# EAGLE schematic ST-BOARD-1-02 (EAGLE 9.3.0)

## Sheet 1 of 4
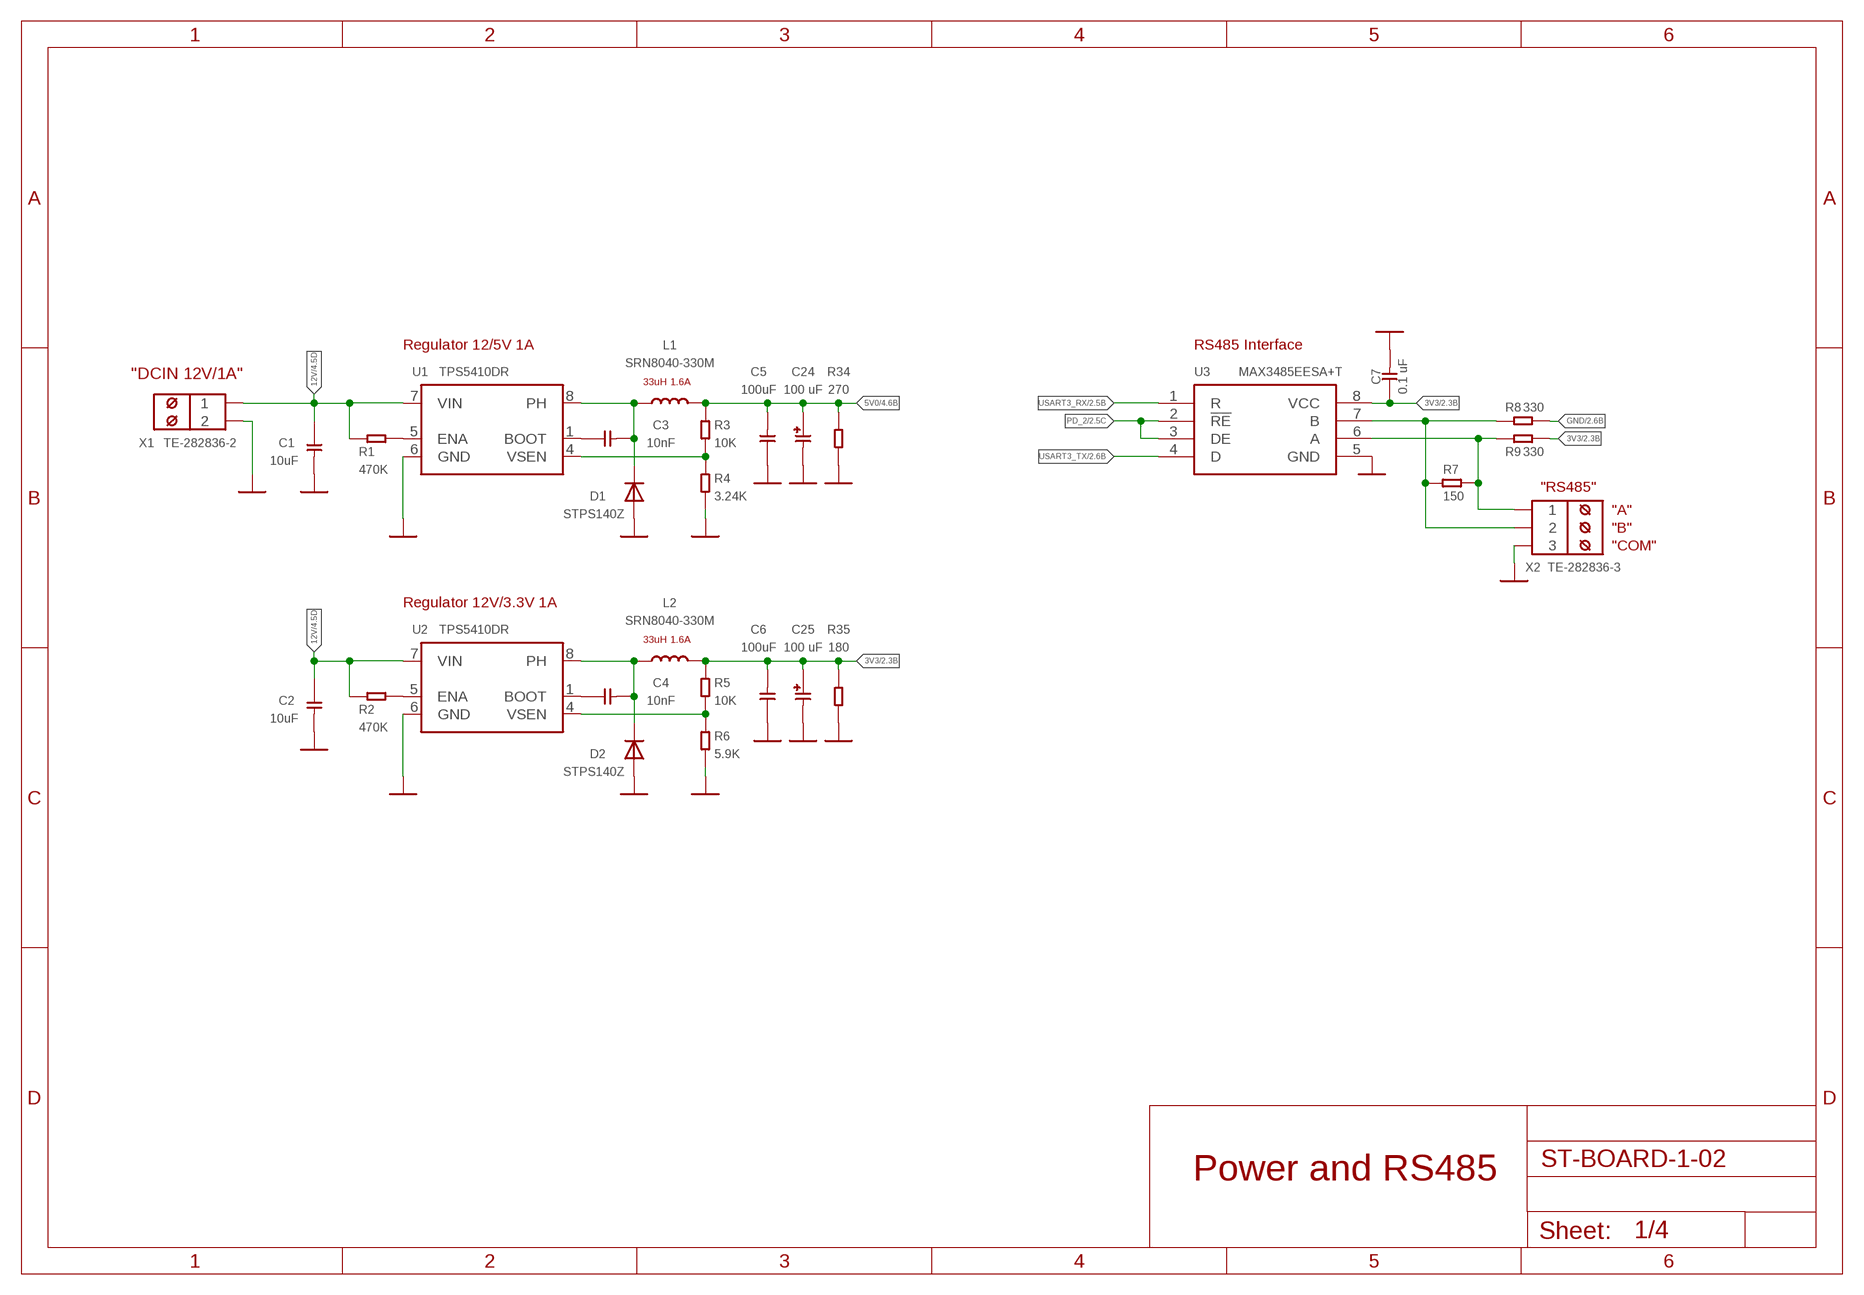
[diagram p0: schematic, sheet 1]

### Parts
C1  10uF  CHIP-CAPACITORC1206  [C1206]
C2  10uF  CHIP-CAPACITORC1206  [C1206]
C3  10nF  CHIP-CAPACITORC0603  [C0603]
C4  10nF  CHIP-CAPACITORC0603  [C0603]
C5  100uF  CHIP-CAPACITORC1206  [C1206]
C6  100uF  CHIP-CAPACITORC1206  [C1206]
C7  0.1 uF  CHIP-CAPACITORC0603  [C0603]
C24  100 uF  TANT-CAPACITOR_D  [CT7343]
C25  100 uF  TANT-CAPACITOR_D  [CT7343]
D1  STPS140Z  DIODE_SOD-123  [SOD-123]
D2  STPS140Z  DIODE_SOD-123  [SOD-123]
L1  SRN8040-330M  CHIP-INDUCTOR_SRN8040  [SRN8040]
L2  SRN8040-330M  CHIP-INDUCTOR_SRN8040  [SRN8040]
R1  470K  CHIP-RESISTOR-0603  [R0603]
R2  470K  CHIP-RESISTOR-0603  [R0603]
R3  10K  CHIP-RESISTOR-0603  [R0603]
R4  3.24K  CHIP-RESISTOR-0603  [R0603]
R5  10K  CHIP-RESISTOR-0603  [R0603]
R6  5.9K  CHIP-RESISTOR-0603  [R0603]
R7  150  CHIP-RESISTOR-0805  [R0805]
R8  330  CHIP-RESISTOR-0603  [R0603]
R9  330  CHIP-RESISTOR-0603  [R0603]
R34  270  CHIP-RESISTOR-1206  [R1206]
R35  180  CHIP-RESISTOR-1206  [R1206]
U1  TPS5410DR  TPS5450_SOIC8  [SOIC8]
U2  TPS5410DR  TPS5450_SOIC8  [SOIC8]
U3  MAX3485EESA+T  MAX3485  [SOIC8]
X1  TE-282836-2  [W237-102]
X2  TE-282836-3  [W237-103]

### Nets
3V3: C6.2 C7.1 C25.+ L2.2 R5.2 R9.1 R35.2 U3.8(VCC) ; also sheet 2,3,4
5V0: C5.2 C24.+ L1.2 R3.2 R34.2 ; also sheet 4
12V: C1.1 C2.1 R1.2 R2.2 U1.7(VIN) U2.7(VIN) X1.1 ; also sheet 4
A: R7.2 R9.2 U3.6(A) X2.1
B: R7.1 R8.2 U3.7(B) X2.2
GND: C1.2 C2.2 C5.1 C6.1 C7.2 C24.- C25.- D1.+ D2.+ R4.1 R6.1 R8.1 R34.1 R35.1 U1.6(GND) U2.6(GND) U3.5(GND) X1.2 X2.3 ; also sheet 2,3,4
LM_SW1: C3.2 D1.- L1.1 U1.8(PH)
LM_SW3: C4.2 D2.- L2.1 U2.8(PH)
N$2: R3.1 R4.2 U1.4(VSEN)
N$3: C3.1 U1.1(BOOT)
N$4: R1.1 U1.5(ENA)
N$10: R5.1 R6.2 U2.4(VSEN)
N$11: C4.1 U2.1(BOOT)
N$12: R2.1 U2.5(ENA)
PD_2: U3.2(!RE) U3.3(DE) ; also sheet 2
USART3_RX: U3.1(R) ; also sheet 2
USART3_TX: U3.4(D) ; also sheet 2

### Notes on the sheet
- Regulator 12/5V 1A | RS485 Interface
- "DCIN 12V/1A"
- 33uH 1.6A
- "RS485"
- "A"
- "B"
- "COM"
- Regulator 12V/3.3V 1A
- 33uH 1.6A
- Power and RS485

## Sheet 2 of 4
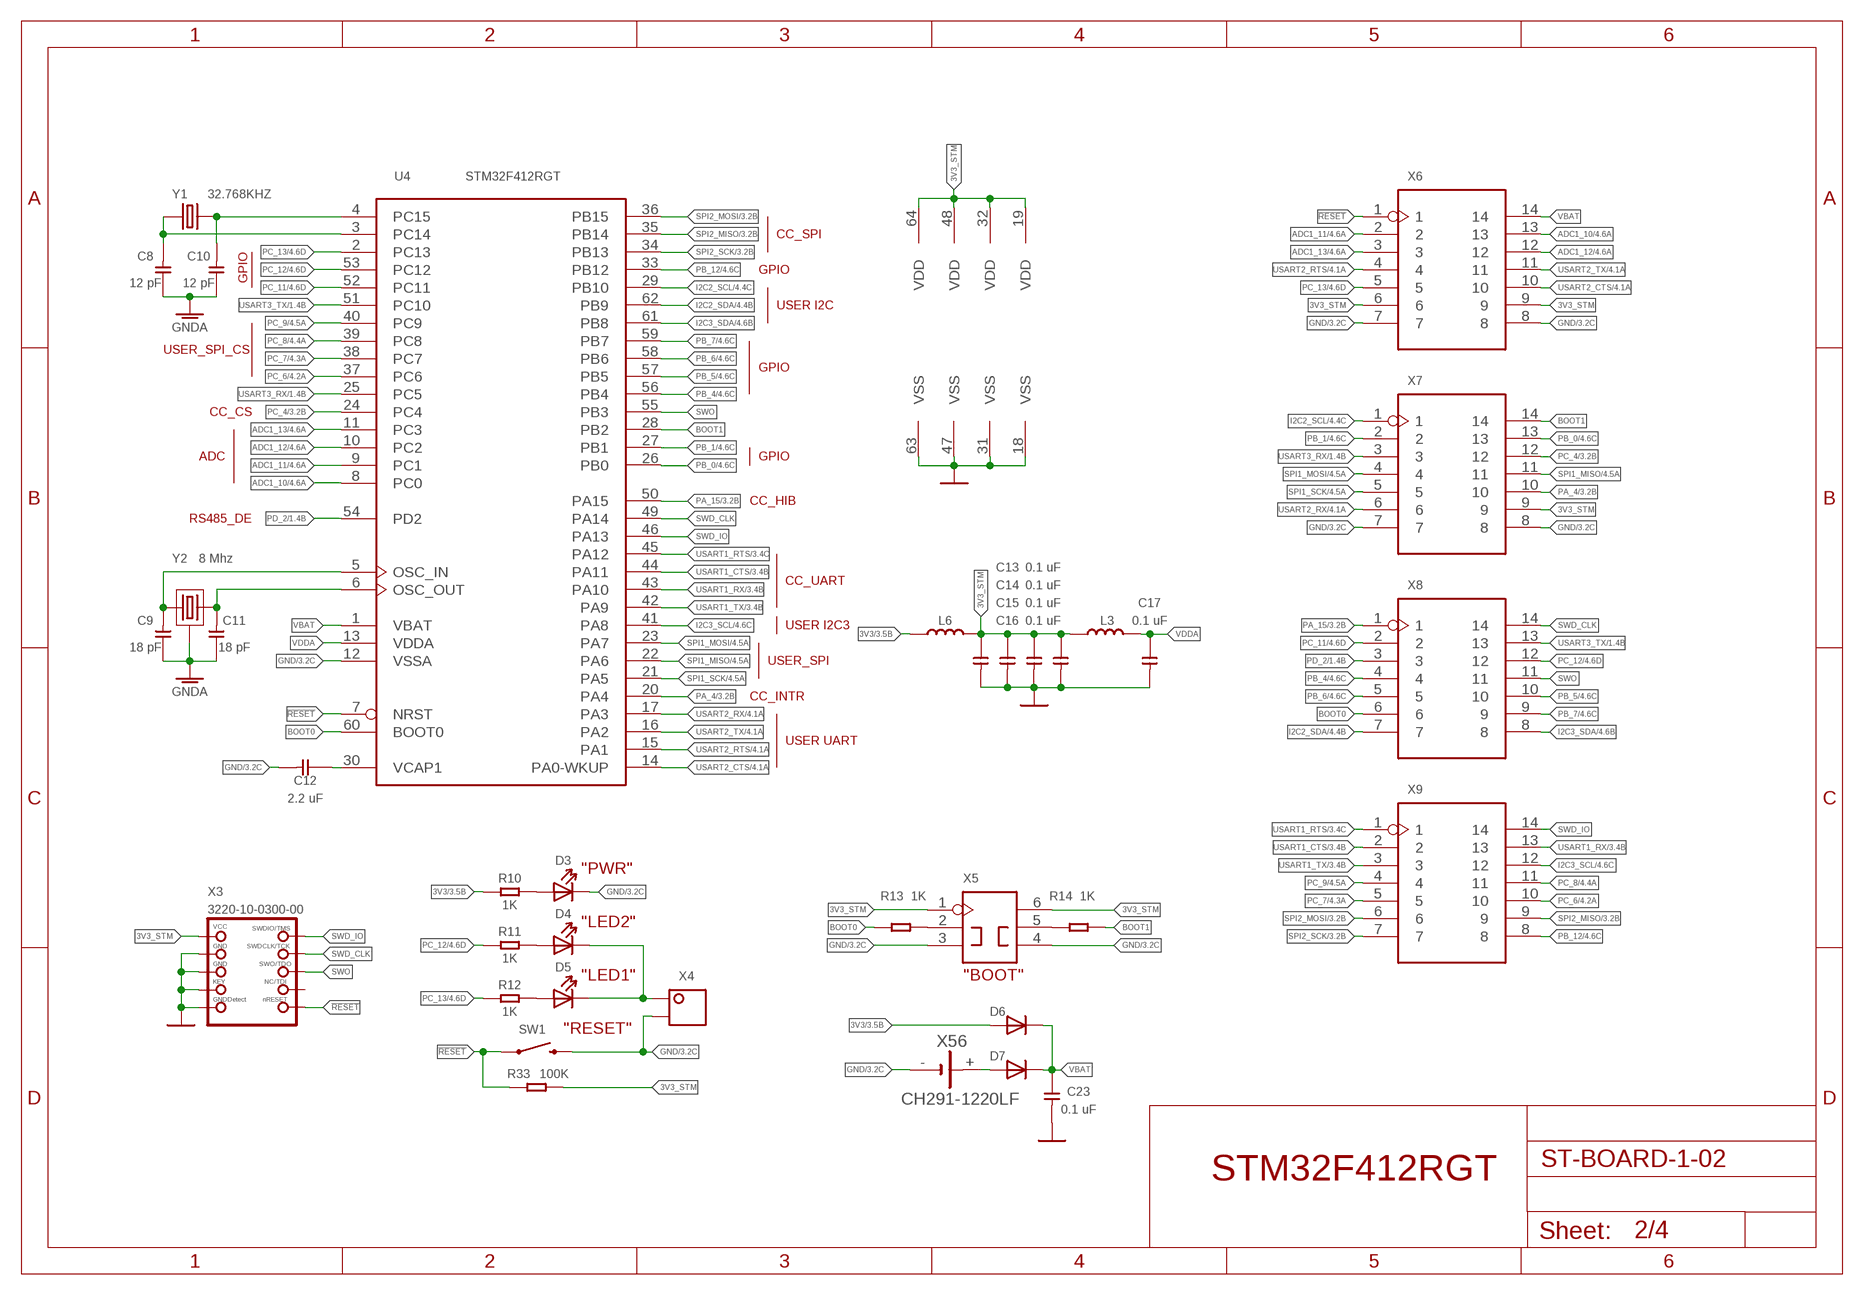
[diagram p1: schematic, sheet 2]

### Parts
C8  12 pF  CHIP-CAPACITORC0603  [C0603]
C9  18 pF  CHIP-CAPACITORC0603  [C0603]
C10  12 pF  CHIP-CAPACITORC0603  [C0603]
C11  18 pF  CHIP-CAPACITORC0603  [C0603]
C12  2.2 uF  CHIP-CAPACITORC0603  [C0603]
C13  0.1 uF  CHIP-CAPACITORC0603  [C0603]
C14  0.1 uF  CHIP-CAPACITORC0603  [C0603]
C15  0.1 uF  CHIP-CAPACITORC0603  [C0603]
C16  0.1 uF  CHIP-CAPACITORC0603  [C0603]
C17  0.1 uF  CHIP-CAPACITORC0603  [C0603]
C23  0.1 uF  CHIP-CAPACITORC0603  [C0603]
D3  LED-0603  [LED-0603]
D4  LED-0603  [LED-0603]
D5  LED-0603  [LED-0603]
D6  DIODE_SOD-523  [SOD-523]
D7  DIODE_SOD-523  [SOD-523]
L3  CHIP-INDUCTOR_L0603  [L0603]
L6  CHIP-INDUCTOR_L0603  [L0603]
R10  1K  CHIP-RESISTOR-0603  [R0603]
R11  1K  CHIP-RESISTOR-0603  [R0603]
R12  1K  CHIP-RESISTOR-0603  [R0603]
R13  1K  CHIP-RESISTOR-0603  [R0603]
R14  1K  CHIP-RESISTOR-0603  [R0603]
R33  100K  CHIP-RESISTOR-0603  [R0603]
SW1  TE-1437566-3  [TE-1437566-3]
U4  STM32F412RGT  [LQFP64]
X3  3220-10-0300-00  JTAG-CORTEXBOX  [2X05_1.27MM_BOX_NOPOSTS]
X4  2p-2.54  DIP-HEADER-VERT(2P-2.54)  [H2-2.54]
X5  2x3p-2.54  DIP-HEADER-VERT(2X3P-2.54）-2.54  [H2X3-2.54]
X6  DIP-HEADER-VERT(2X7P-2.54)  [H2X7-2.54]
X7  DIP-HEADER-VERT(2X7P-2.54)  [H2X7-2.54]
X8  DIP-HEADER-VERT(2X7P-2.54)  [H2X7-2.54]
X9  DIP-HEADER-VERT(2X7P-2.54)  [H2X7-2.54]
X56  CH291-1220LF  [CH291-1220LF]
Y1  32.768KHZ  SMD-CRYSTAL_32X15  [3.2X1.5]
Y2  8 Mhz  SMD-CRYSTAL-3225_5032B  [IQG5032B]

### Nets
3V3: D6.+ L6.1 R10.1 ; also sheet 1,3,4
3V3_STM: C13.1 C14.1 C15.1 C16.1 L3.2 L6.2 R33.1 U4.19(VDD) U4.32(VDD) U4.48(VDD) U4.64(VDD) X3.1(VCC) X5.1 X5.6 X6.6 X6.9 X7.9
!RESET: R33.2 SW1.P$1 U4.7(NRST) X3.10(NRESET) X6.1
ADC1_10: U4.8(PC0) X6.13 ; also sheet 4
ADC1_11: U4.9(PC1) X6.2 ; also sheet 4
ADC1_12: U4.10(PC2) X6.12 ; also sheet 4
ADC1_13: U4.11(PC3) X6.3 ; also sheet 4
BOOT0: R13.1 U4.60(BOOT0) X8.6
BOOT1: R14.1 U4.28(PB2) X7.14
GND: C12.2 C13.2 C14.2 C15.2 C16.2 C17.2 C23.2 D3.- SW1.P$2 U4.12(VSSA) U4.18(VSS) U4.31(VSS) U4.47(VSS) U4.63(VSS) X3.3(GND) X3.5(GND) X3.7(KEY) X3.9(GNDDETECT) X4.2 X5.3 X5.4 X6.7 X6.8 X7.7 X7.8 X56.- ; also sheet 1,3,4
GNDA: C8.1 C9.1 C10.1 C11.1 Y2.2(GND) Y2.4(GND)
I2C2_SCL: U4.29(PB10) X7.1 ; also sheet 4
I2C2_SDA: U4.62(PB9) X8.7 ; also sheet 4
I2C3_SCL: U4.41(PA8) X9.12 ; also sheet 4
I2C3_SDA: U4.61(PB8) X8.8 ; also sheet 4
N$1: C10.2 U4.4(PC15) Y1.2
N$6: C8.2 U4.3(PC14) Y1.1
N$8: C12.1 U4.30(VCAP1)
N$42: C11.2 U4.6(OSC_OUT) Y2.3
N$43: C9.2 U4.5(OSC_IN) Y2.1
N$44: D3.+ R10.2
N$45: D4.+ R11.2
N$46: D5.+ R12.2
N$47: D7.+ X56.+
N$48: R14.2 X5.5
N$49: R13.2 X5.2
N$50: D4.- D5.- X4.1
PA_4: U4.20(PA4) X7.10 ; also sheet 3
PA_15: U4.50(PA15) X8.1 ; also sheet 3
PB_0: U4.26(PB0) X7.13 ; also sheet 4
PB_1: U4.27(PB1) X7.2 ; also sheet 4
PB_4: U4.56(PB4) X8.4 ; also sheet 4
PB_5: U4.57(PB5) X8.10 ; also sheet 4
PB_6: U4.58(PB6) X8.5 ; also sheet 4
PB_7: U4.59(PB7) X8.9 ; also sheet 4
PB_12: U4.33(PB12) X9.8 ; also sheet 4
PC_4: U4.24(PC4) X7.12 ; also sheet 3
PC_6: U4.37(PC6) X9.10 ; also sheet 4
PC_7: U4.38(PC7) X9.5 ; also sheet 4
PC_8: U4.39(PC8) X9.11 ; also sheet 4
PC_9: U4.40(PC9) X9.4 ; also sheet 4
PC_11: U4.52(PC11) X8.2 ; also sheet 4
PC_12: R11.1 U4.53(PC12) X8.12 ; also sheet 4
PC_13: R12.1 U4.2(PC13) X6.5 ; also sheet 4
PD_2: U4.54(PD2) X8.3 ; also sheet 1
SPI1_MISO: U4.22(PA6) X7.11 ; also sheet 4
SPI1_MOSI: U4.23(PA7) X7.4 ; also sheet 4
SPI1_SCK: U4.21(PA5) X7.5 ; also sheet 4
SPI2_MISO: U4.35(PB14) X9.9 ; also sheet 3
SPI2_MOSI: U4.36(PB15) X9.6 ; also sheet 3
SPI2_SCK: U4.34(PB13) X9.7 ; also sheet 3
SWD_CLK: U4.49(PA14) X3.4(SWDCLK) X8.14
SWD_IO: U4.46(PA13) X3.2(SWDIO) X9.14
SWO: U4.55(PB3) X3.6(SWO) X8.11
USART1_CTS: U4.44(PA11) X9.2 ; also sheet 3
USART1_RTS: U4.45(PA12) X9.1 ; also sheet 3
USART1_RX: U4.43(PA10) X9.13 ; also sheet 3
USART1_TX: U4.42(PA9) X9.3 ; also sheet 3
USART2_CTS: U4.14(PA0-WKUP) X6.10 ; also sheet 4
USART2_RTS: U4.15(PA1) X6.4 ; also sheet 4
USART2_RX: U4.17(PA3) X7.6 ; also sheet 4
USART2_TX: U4.16(PA2) X6.11 ; also sheet 4
USART3_RX: U4.25(PC5) X7.3 ; also sheet 1
USART3_TX: U4.51(PC10) X8.13 ; also sheet 1
VBAT: C23.1 D6.- D7.- U4.1(VBAT) X6.14
VDDA: C17.1 L3.1 U4.13(VDDA)
Unconnected: X3.8(TDI)

### Notes on the sheet
- CC_SPI
- GPIO
- GPIO
- USER I2C
- USER_SPI_CS
- GPIO
- CC_CS
- ADC | GPIO
- CC_HIB
- RS485_DE
- CC_UART
- USER I2C3
- USER_SPI
- CC_INTR
- USER UART
- "PWR"
- "LED2"
- "LED1" | "BOOT"
- "RESET"
- STM32F412RGT

## Sheet 3 of 4
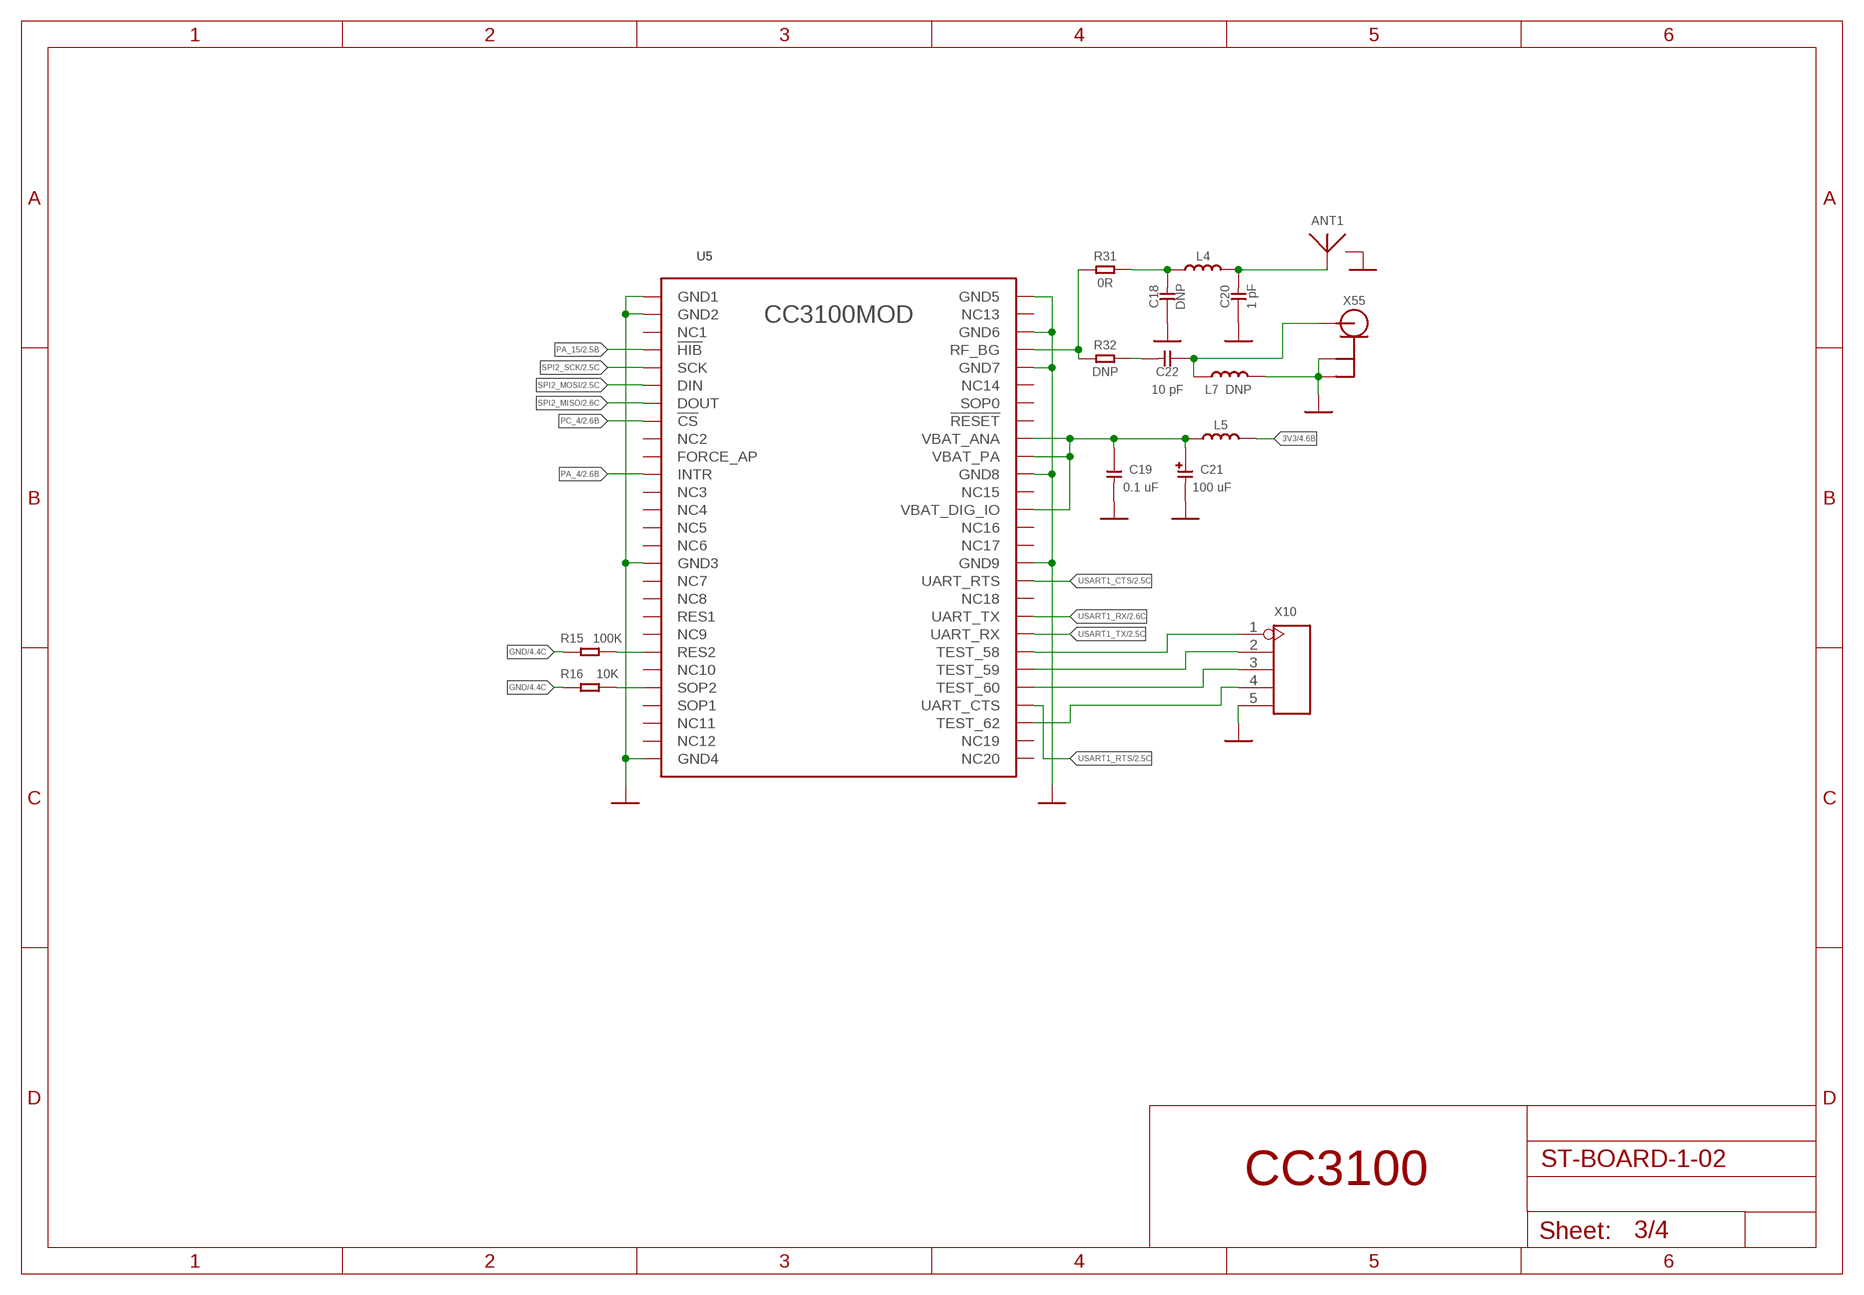
[diagram p2: schematic, sheet 3]

### Parts
ANT1  AH316M245001-T  AH316M  [AH316M]
C18  DNP  CHIP-CAPACITORC0402  [C0402]
C19  0.1 uF  CHIP-CAPACITORC0603  [C0603]
C20  1 pF  CHIP-CAPACITORC0402  [C0402]
C21  100 uF  TANT-CAPACITOR_B  [CT3528]
C22  10 pF  CHIP-CAPACITORC0402  [C0402]
L4  CHIP-INDUCTOR_L0402  [L0402]
L5  CHIP-INDUCTOR_L0603  [L0603]
L7  DNP  CHIP-INDUCTOR_L0402  [L0402]
R15  100K  CHIP-RESISTOR-0603  [R0603]
R16  10K  CHIP-RESISTOR-0603  [R0603]
R31  0R  CHIP-RESISTOR-0402  [R0402]
R32  DNP  CHIP-RESISTOR-0402  [R0402]
U5  CC3100MOD  [CC3100MOD]
X10  2p-2.54  DIP-HEADER-VERT(5P-2.54)  [H5-2.54]
X55  UFL3  [U-FL3P-SMD-2.6X2.6X1.0MM]

### Nets
3V3: L5.2 ; also sheet 1,2,4
GND: ANT1.P$2(GND) C18.1 C19.2 C20.1 C21.- L7.2 R15.1 R16.1 U5.P1(GND1) U5.P2(GND2) U5.P16(GND3) U5.P27(GND4) U5.P28(GND5) U5.P30(GND6) U5.P32(GND7) U5.P38(GND8) U5.P43(GND9) U5.P55(GND1) U5.P56(GND1) U5.P57(GND1) U5.P58(GND1) U5.P59(GND1) U5.P60(GND1) U5.P61(GND1) U5.P62(GND1) U5.P63(GND1) X10.5 X55.GND1(GND) X55.GND2(GND1) ; also sheet 1,2,4
N$9: R15.2 U5.P21(RES2)
N$14: R16.2 U5.P23(SOP2)
N$15 [rf]: R31.1 R32.1 U5.P31(RF_BG)
N$16 [rf]: ANT1.P$1(ANT) C20.2 L4.2
N$20: C19.1 C21.+ L5.1 U5.P36(VBAT_ANA) U5.P37(VBAT_PA) U5.P40(VBAT_DIG_IO)
N$52 [rf]: C18.2 L4.1 R31.2
N$53 [rf]: C22.2 R32.2
N$54 [rf]: C22.1 L7.1 X55.D(ANT)
PA_4: U5.P11(INTR) ; also sheet 2
PA_15: U5.P4(!HIB) ; also sheet 2
PC_4: U5.P8(!CS) ; also sheet 2
SPI2_MISO: U5.P7(DOUT) ; also sheet 2
SPI2_MOSI: U5.P6(DIN) ; also sheet 2
SPI2_SCK: U5.P5(SCK) ; also sheet 2
TEST_58: U5.P48(TEST_58) X10.1
TEST_59: U5.P49(TEST_59) X10.2
TEST_60: U5.P50(TEST_60) X10.3
TEST_62: U5.P52(TEST_62) X10.4
USART1_CTS: U5.P44(UART_RTS) ; also sheet 2
USART1_RTS: U5.P51(UART_CTS) ; also sheet 2
USART1_RX: U5.P46(UART_TX) ; also sheet 2
USART1_TX: U5.P47(UART_RX) ; also sheet 2
Unconnected: U5.P3(NC1) U5.P9(NC2) U5.P10(FORCE_AP) U5.P12(NC3) U5.P13(NC4) U5.P14(NC5) U5.P15(NC6) U5.P17(NC7) U5.P18(NC8) U5.P19(RES1) U5.P20(NC9) U5.P22(NC10) U5.P24(SOP1) U5.P25(NC11) U5.P26(NC12) U5.P29(NC13) U5.P33(NC14) U5.P34(SOP0) U5.P35(!RESET) U5.P39(NC15) U5.P41(NC16) U5.P42(NC17) U5.P45(NC18) U5.P53(NC19) U5.P54(NC20)

### Notes on the sheet
- CC3100

## Sheet 4 of 4
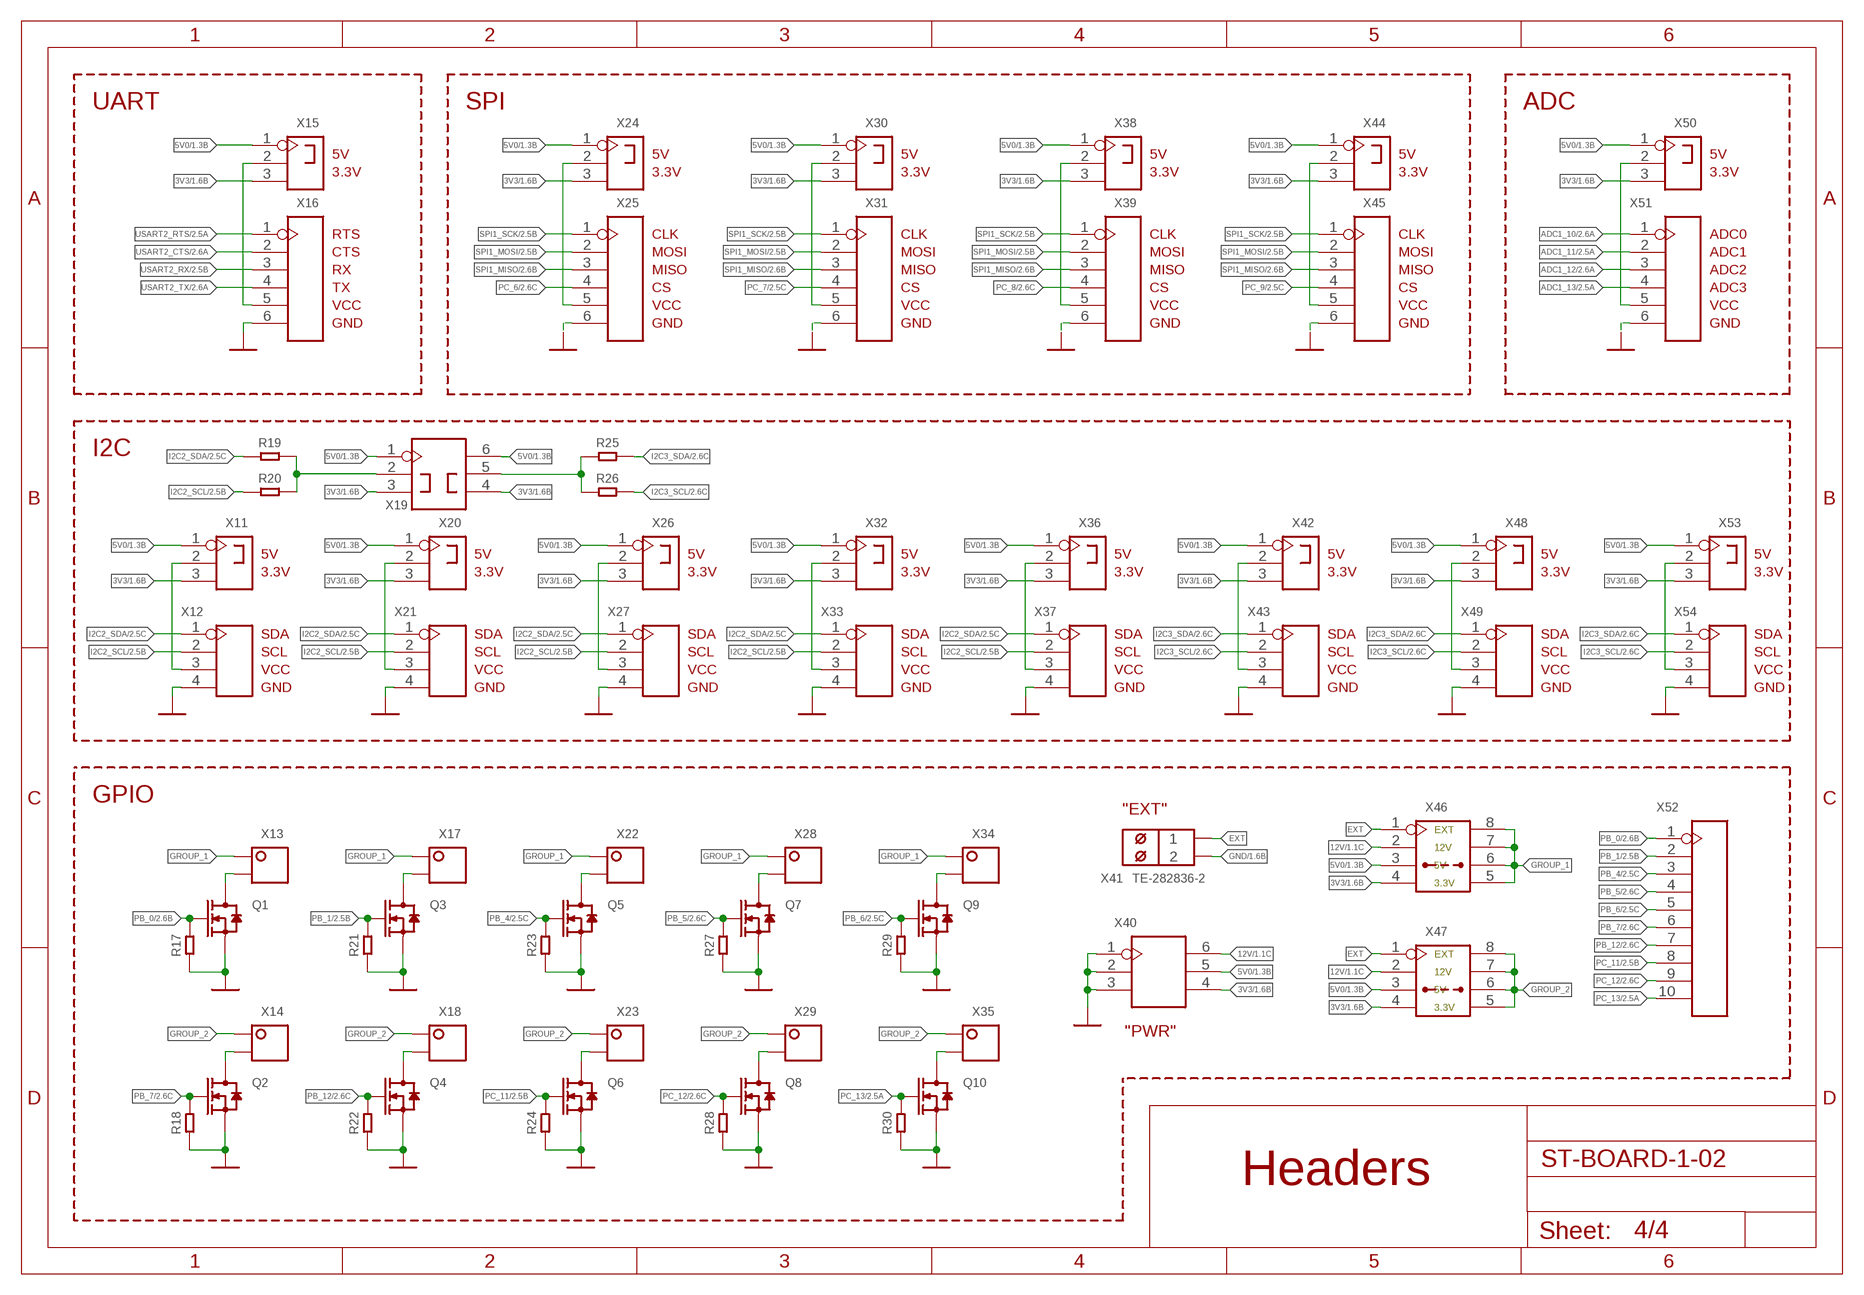
[diagram p3: schematic, sheet 4]

### Parts
Q1  MOSFET-N-(SOT-23)  [SOT-23]
Q2  MOSFET-N-(SOT-23)  [SOT-23]
Q3  MOSFET-N-(SOT-23)  [SOT-23]
Q4  MOSFET-N-(SOT-23)  [SOT-23]
Q5  MOSFET-N-(SOT-23)  [SOT-23]
Q6  MOSFET-N-(SOT-23)  [SOT-23]
Q7  MOSFET-N-(SOT-23)  [SOT-23]
Q8  MOSFET-N-(SOT-23)  [SOT-23]
Q9  MOSFET-N-(SOT-23)  [SOT-23]
Q10  MOSFET-N-(SOT-23)  [SOT-23]
R17  CHIP-RESISTOR-0603  [R0603]
R18  CHIP-RESISTOR-0603  [R0603]
R19  CHIP-RESISTOR-0603  [R0603]
R20  CHIP-RESISTOR-0603  [R0603]
R21  CHIP-RESISTOR-0603  [R0603]
R22  CHIP-RESISTOR-0603  [R0603]
R23  CHIP-RESISTOR-0603  [R0603]
R24  CHIP-RESISTOR-0603  [R0603]
R25  CHIP-RESISTOR-0603  [R0603]
R26  CHIP-RESISTOR-0603  [R0603]
R27  CHIP-RESISTOR-0603  [R0603]
R28  CHIP-RESISTOR-0603  [R0603]
R29  CHIP-RESISTOR-0603  [R0603]
R30  CHIP-RESISTOR-0603  [R0603]
X11  3p-2.54  DIP-HEADER-VERT(3P-2.54)_M  [H3-2.54]
X12  DIP-HEADER-VERT(4P-2.54)_WF  [22-23-2041]
X13  2p-2.54  DIP-HEADER-VERT(2P-2.54)_WF  [22-23-2021]
X14  2p-2.54  DIP-HEADER-VERT(2P-2.54)_WF  [22-23-2021]
X15  3p-2.54  DIP-HEADER-VERT(3P-2.54)_M  [H3-2.54]
X16  DIP-HEADER-VERT(6P-2.54)_WF  [22-23-2061]
X17  2p-2.54  DIP-HEADER-VERT(2P-2.54)_WF  [22-23-2021]
X18  2p-2.54  DIP-HEADER-VERT(2P-2.54)_WF  [22-23-2021]
X19  2x3p-2.54  DIP-HEADER-VERT(2X3P-2.54）-2.54  [H2X3-2.54]
X20  3p-2.54  DIP-HEADER-VERT(3P-2.54)_M  [H3-2.54]
X21  DIP-HEADER-VERT(4P-2.54)_WF  [22-23-2041]
X22  2p-2.54  DIP-HEADER-VERT(2P-2.54)_WF  [22-23-2021]
X23  2p-2.54  DIP-HEADER-VERT(2P-2.54)_WF  [22-23-2021]
X24  3p-2.54  DIP-HEADER-VERT(3P-2.54)_M  [H3-2.54]
X25  DIP-HEADER-VERT(6P-2.54)_WF  [22-23-2061]
X26  3p-2.54  DIP-HEADER-VERT(3P-2.54)_M  [H3-2.54]
X27  DIP-HEADER-VERT(4P-2.54)_WF  [22-23-2041]
X28  2p-2.54  DIP-HEADER-VERT(2P-2.54)_WF  [22-23-2021]
X29  2p-2.54  DIP-HEADER-VERT(2P-2.54)_WF  [22-23-2021]
X30  3p-2.54  DIP-HEADER-VERT(3P-2.54)_M  [H3-2.54]
X31  DIP-HEADER-VERT(6P-2.54)_WF  [22-23-2061]
X32  3p-2.54  DIP-HEADER-VERT(3P-2.54)_M  [H3-2.54]
X33  DIP-HEADER-VERT(4P-2.54)_WF  [22-23-2041]
X34  2p-2.54  DIP-HEADER-VERT(2P-2.54)_WF  [22-23-2021]
X35  2p-2.54  DIP-HEADER-VERT(2P-2.54)_WF  [22-23-2021]
X36  3p-2.54  DIP-HEADER-VERT(3P-2.54)_M  [H3-2.54]
X37  DIP-HEADER-VERT(4P-2.54)_WF  [22-23-2041]
X38  3p-2.54  DIP-HEADER-VERT(3P-2.54)_M  [H3-2.54]
X39  DIP-HEADER-VERT(6P-2.54)_WF  [22-23-2061]
X40  2x3p-2.54  DIP-HEADER-VERT(2X3P-2.54）-2.54  [H2X3-2.54]
X41  TE-282836-2  [W237-102]
X42  3p-2.54  DIP-HEADER-VERT(3P-2.54)_M  [H3-2.54]
X43  DIP-HEADER-VERT(4P-2.54)_WF  [22-23-2041]
X44  3p-2.54  DIP-HEADER-VERT(3P-2.54)_M  [H3-2.54]
X45  DIP-HEADER-VERT(6P-2.54)_WF  [22-23-2061]
X46  2x4p-2.54  DIP-HEADER-VERT(2X4P-2.54)  [H2X4-2.54]
X47  2x4p-2.54  DIP-HEADER-VERT(2X4P-2.54)  [H2X4-2.54]
X48  3p-2.54  DIP-HEADER-VERT(3P-2.54)_M  [H3-2.54]
X49  DIP-HEADER-VERT(4P-2.54)_WF  [22-23-2041]
X50  3p-2.54  DIP-HEADER-VERT(3P-2.54)_M  [H3-2.54]
X51  DIP-HEADER-VERT(6P-2.54)  [H6-2.54]
X52  DIP-HEADER-VERT(10P-2.54)  [H10-2.54]
X53  3p-2.54  DIP-HEADER-VERT(3P-2.54)_M  [H3-2.54]
X54  DIP-HEADER-VERT(4P-2.54)_WF  [22-23-2041]

### Nets
3V3: X11.3 X15.3 X19.3 X19.4 X20.3 X24.3 X26.3 X30.3 X32.3 X36.3 X38.3 X40.4 X42.3 X44.3 X46.4 X47.4 X48.3 X50.3 X53.3 ; also sheet 1,2,3
5V0: X11.1 X15.1 X19.1 X19.6 X20.1 X24.1 X26.1 X30.1 X32.1 X36.1 X38.1 X40.5 X42.1 X44.1 X46.3 X47.3 X48.1 X50.1 X53.1 ; also sheet 1
12V: X40.6 X46.2 X47.2 ; also sheet 1
ADC1_10: X51.1 ; also sheet 2
ADC1_11: X51.2 ; also sheet 2
ADC1_12: X51.3 ; also sheet 2
ADC1_13: X51.4 ; also sheet 2
EXT: X41.1 X46.1 X47.1
GND: Q1.2(S) Q2.2(S) Q3.2(S) Q4.2(S) Q5.2(S) Q6.2(S) Q7.2(S) Q8.2(S) Q9.2(S) Q10.2(S) R17.1 R18.1 R21.1 R22.1 R23.1 R24.1 R27.1 R28.1 R29.1 R30.1 X12.4 X16.6 X21.4 X25.6 X27.4 X31.6 X33.4 X37.4 X39.6 X40.1 X40.2 X40.3 X41.2 X43.4 X45.6 X49.4 X51.6 X54.4 ; also sheet 1,2,3
GROUP_1: X13.1 X17.1 X22.1 X28.1 X34.1 X46.5 X46.6 X46.7 X46.8
GROUP_2: X14.1 X18.1 X23.1 X29.1 X35.1 X47.5 X47.6 X47.7 X47.8
I2C2_SCL: R20.1 X12.2 X21.2 X27.2 X33.2 X37.2 ; also sheet 2
I2C2_SDA: R19.1 X12.1 X21.1 X27.1 X33.1 X37.1 ; also sheet 2
I2C3_SCL: R26.1 X43.2 X49.2 X54.2 ; also sheet 2
I2C3_SDA: R25.1 X43.1 X49.1 X54.1 ; also sheet 2
N$7: R19.2 R20.2 X19.2
N$17: X11.2 X12.3
N$18: X20.2 X21.3
N$19: X15.2 X16.5
N$21: X26.2 X27.3
N$22: Q1.3(D) X13.2
N$23: Q3.3(D) X17.2
N$24: X32.2 X33.3
N$25: X36.2 X37.3
N$26: X42.2 X43.3
N$27: X48.2 X49.3
N$28: X53.2 X54.3
N$29: X24.2 X25.5
N$30: X30.2 X31.5
N$31: X38.2 X39.5
N$32: X44.2 X45.5
N$33: X50.2 X51.5
N$34: Q5.3(D) X22.2
N$35: Q7.3(D) X28.2
N$36: Q9.3(D) X34.2
N$37: Q2.3(D) X14.2
N$38: Q4.3(D) X18.2
N$39: Q6.3(D) X23.2
N$40: Q8.3(D) X29.2
N$41: Q10.3(D) X35.2
N$51: R25.2 R26.2 X19.5
PB_0: Q1.1(G) R17.2 X52.1 ; also sheet 2
PB_1: Q3.1(G) R21.2 X52.2 ; also sheet 2
PB_4: Q5.1(G) R23.2 X52.3 ; also sheet 2
PB_5: Q7.1(G) R27.2 X52.4 ; also sheet 2
PB_6: Q9.1(G) R29.2 X52.5 ; also sheet 2
PB_7: Q2.1(G) R18.2 X52.6 ; also sheet 2
PB_12: Q4.1(G) R22.2 X52.7 ; also sheet 2
PC_6: X25.4 ; also sheet 2
PC_7: X31.4 ; also sheet 2
PC_8: X39.4 ; also sheet 2
PC_9: X45.4 ; also sheet 2
PC_11: Q6.1(G) R24.2 X52.8 ; also sheet 2
PC_12: Q8.1(G) R28.2 X52.9 ; also sheet 2
PC_13: Q10.1(G) R30.2 X52.10 ; also sheet 2
SPI1_MISO: X25.3 X31.3 X39.3 X45.3 ; also sheet 2
SPI1_MOSI: X25.2 X31.2 X39.2 X45.2 ; also sheet 2
SPI1_SCK: X25.1 X31.1 X39.1 X45.1 ; also sheet 2
USART2_CTS: X16.2 ; also sheet 2
USART2_RTS: X16.1 ; also sheet 2
USART2_RX: X16.3 ; also sheet 2
USART2_TX: X16.4 ; also sheet 2

### Notes on the sheet
- UART | SPI | ADC
- 5V | 5V | 5V | 5V | 5V | 5V
- 3.3V | 3.3V | 3.3V | 3.3V | 3.3V | 3.3V
- RTS | CLK | CLK | CLK | CLK | ADC0
- CTS | MOSI | MOSI | MOSI | MOSI | ADC1
- RX | MISO | MISO | MISO | MISO | ADC2
- TX | CS | CS | CS | CS | ADC3
- VCC | VCC | VCC | VCC | VCC | VCC
- GND | GND | GND | GND | GND | GND
- I2C
- 5V | 5V | 5V | 5V | 5V | 5V | 5V | 5V
- 3.3V | 3.3V | 3.3V | 3.3V | 3.3V | 3.3V | 3.3V | 3.3V
- SDA | SDA | SDA | SDA | SDA | SDA | SDA | SDA
- SCL | SCL | SCL | SCL | SCL | SCL | SCL | SCL
- VCC | VCC | VCC | VCC | VCC | VCC | VCC | VCC
- GND | GND | GND | GND | GND | GND | GND | GND
- GPIO | "EXT"
- EXT
- 12V
- 5V
- 3.3V
- EXT
- 12V
- 5V
- 3.3V
- "PWR"
- Headers

## Library data of the parts
ANT1 = antennas:AH316M
C1-C20 C22 C23 = rcl:CHIP-CAPACITOR: 302010243
C21 C24 C25 = rcl:TANT-CAPACITOR: 302010243
D1 D2 D6 D7 = diodes:DIODE: 304030010
D3-D5 = diodes:LED-0603
L1-L7 = rcl:CHIP-INDUCTOR: 303010087
Q1-Q10 = transistors:MOSFET-N-(SOT-23): 305030026
R1-R35 = rcl:CHIP-RESISTOR
SW1 = connectors:TE-1437566-3
U1 U2 = ic:TPS5450
U3 = ic:MAX3485
U4 = ic:STM32F412R*T: ARM 32-bit Cortex™-M4 CPU 100 MHz maximum frequency 512 to 1024 Kbytes of Flash memory 256 kbytes of SRAM 50 GPIOs 1.7 to 3.6 V application supply
U5 = modules:CC3100MOD
X1 X41 = connectors:TE-282836-2
X2 = connectors:TE-282836-3
X3 = connectors:JTAG-CORTEX: Serial Wire (SW-DP) Connector Standard 0.05" 10-pin connector is for use with the Cortex M and Cortex A SWD (serial wire debugger) interface (SW-DP) Connectors 2x05_1.27MM_SMT - Inexpensive surface-mount header with bare pins, compatible with standard 10-pin SWD cables (4UCON: 16846) 2x05_1.27MM_BOX_NOPOSTS - Polarised surface-mount box (4UCON with caps: 19735, without caps: 15117 2x05_1.27MM_BOX_POSTS - Polarised surface-mount box with mounting holes (4UCON: 20317) Pinout: http://infocenter.arm.com/help/topic/com.arm.doc.faqs/attached/13634/cortex_debug_connectors.pdf http://www.keil.com/peripherals/coresight/connectors.asp
X4 = connectors:DIP-HEADER-VERT(2P-2.54): 320030023; MPN: F185-1102A1BSYA1
X5 X19 X40 = connectors:DIP-HEADER-VERT(2X3P-2.54）: 320020077; MPN: P125-12A1BS116A1
X6-X9 = connectors:DIP-HEADER-VERT(2X7P-2.54): 320030036
X10 = connectors:DIP-HEADER-VERT(5P-2.54): 320020040
X11 X15 X20 X24 X26 X30 X32 X36 X38 X42 X44 X48 X50 X53 = connectors:DIP-HEADER-VERT(3P-2.54)_M: 320030024; MPN: F185-1103A0BSYA1
X12 X21 X27 X33 X37 X43 X49 X54 = connectors:DIP-HEADER-VERT(4P-2.54): 320030024
X13 X14 X17 X18 X22 X23 X28 X29 X34 X35 = connectors:DIP-HEADER-VERT(2P-2.54): 320030023
X16 X25 X31 X39 X45 X51 = connectors:DIP-HEADER-VERT(6P-2.54): 320030031
X46 X47 = connectors:DIP-HEADER-VERT(2X4P-2.54): 320020029; MPN: P125-1208A0BS116A2
X52 = connectors:DIP-HEADER-VERT(10P-2.54): 320030031
X55 = antennas:UFL3
X56 = battery:CH291-1220LF: Battery Holder, SMT, 12mm multicomp PART NO. CH291-1220LF Source: Data sheet <http://www.farnell.com/datasheets/1505860.pdf>
Y1 = crystals:SMD-CRYSTAL: 306010055; MPN: KX-327NHT 32.768 kHz GEYER
Y2 = crystals:SMD-CRYSTAL-3225: 306010055

## Net classes
1 rf: width 0.508 mm, clearance 0.254 mm